# Altium project ESP32SSMB V1.2 .PrjPcb
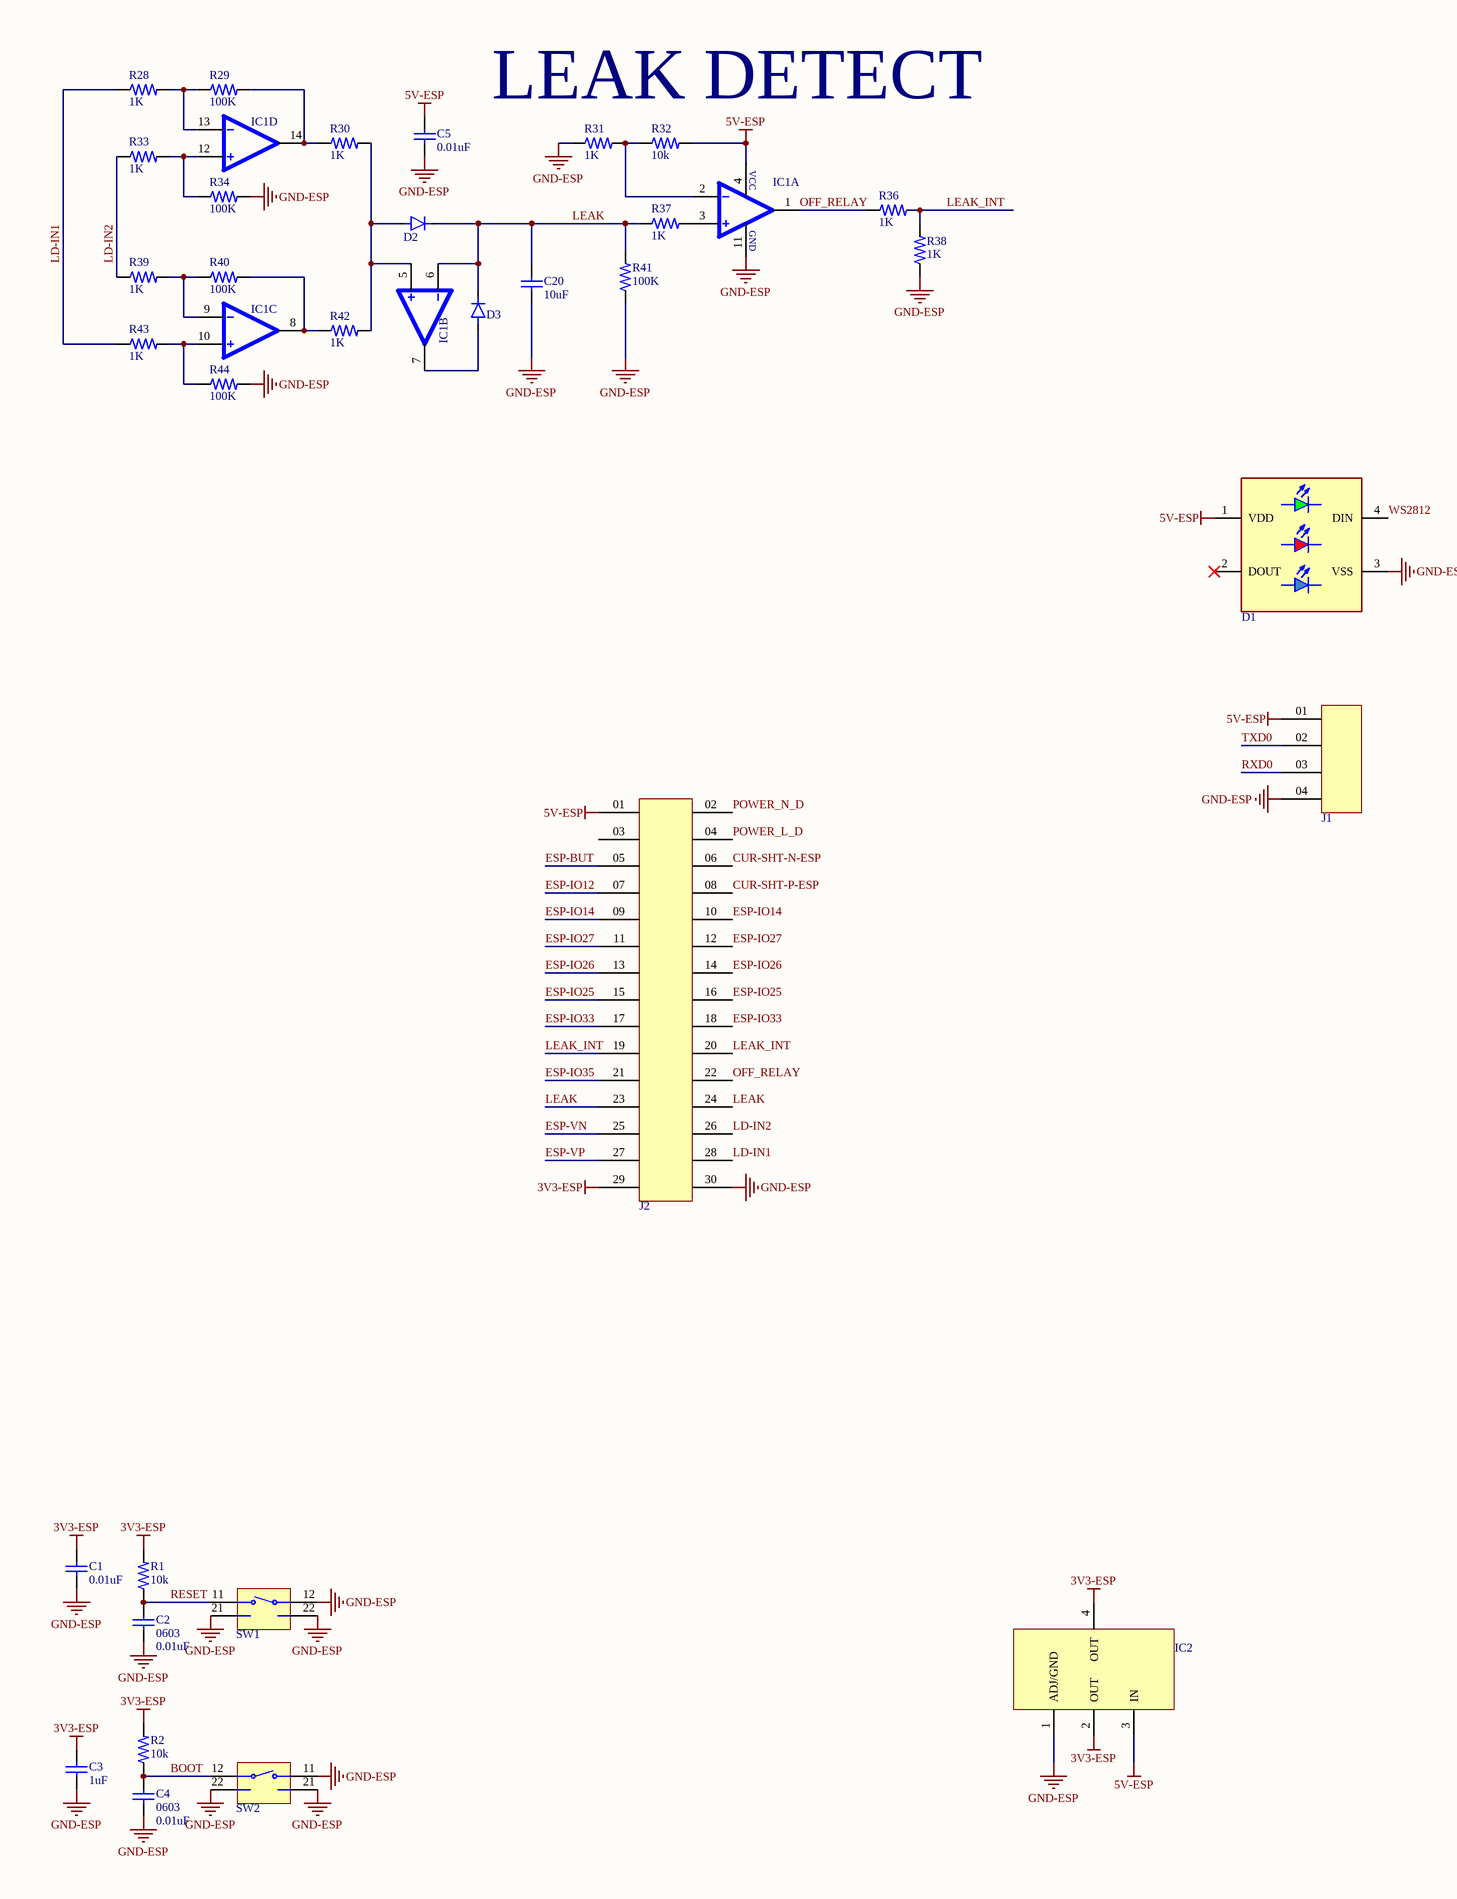
[diagram p0: ESP32SSMB V1.2 .SchDoc, left]
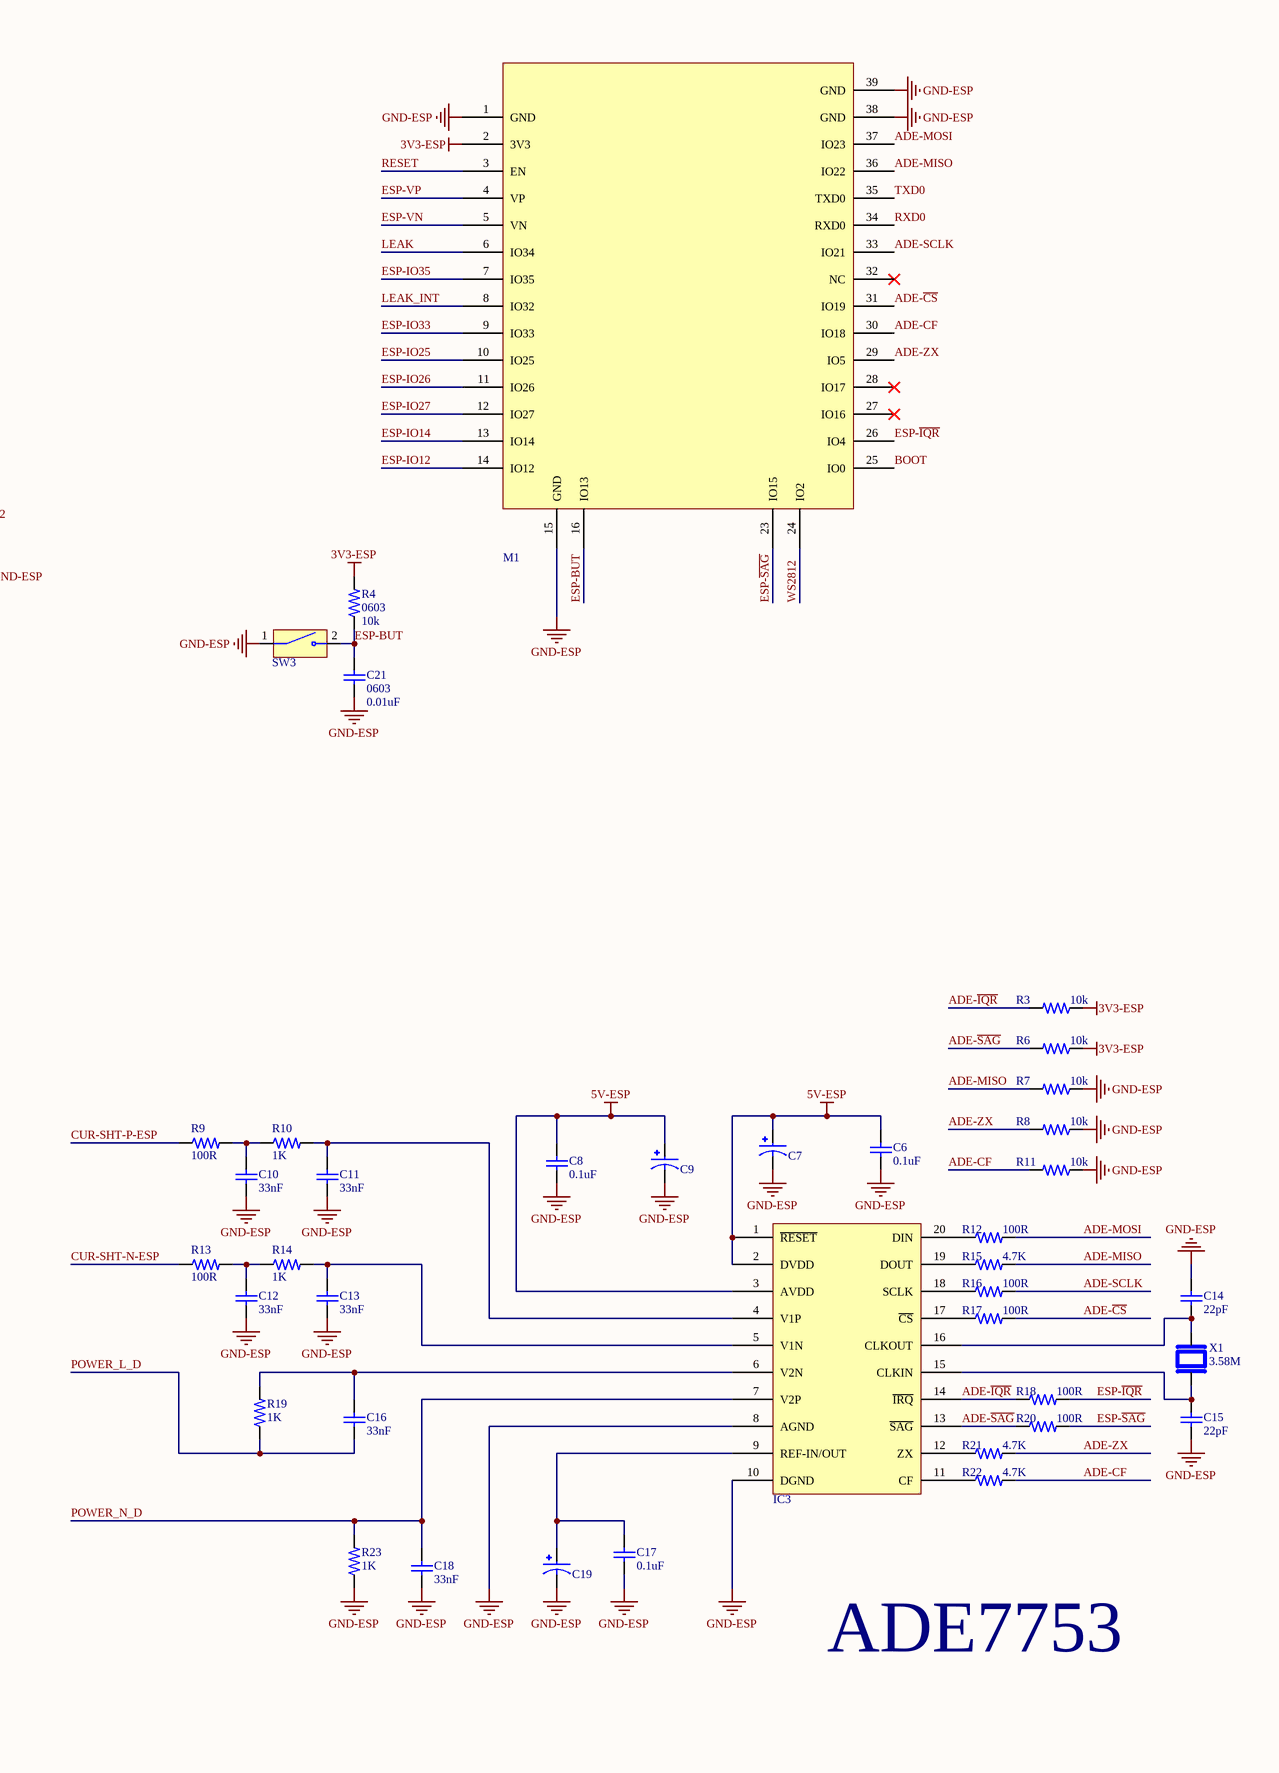
[diagram p1: ESP32SSMB V1.2 .SchDoc, right]
1 sheet, 72 parts. Net scope: global (net labels, ports and power ports of the same name join across sheets).
Board file: ESP32SSMB V1.2 .PcbDoc

## Sheet ESP32SSMB V1.2 .SchDoc
size A2; SheetNumber: 1; SheetTotal: 1

### Parts
C1  value 0.01uF  [SMD-CAP-0603-YAGEO]  (hidden comment: 0.1 µF ±10% 10V Ceramic Capacitor X7R 0603 (1608 Metric))
C2  value 0.01uF  Package: 0603  [SMD-CAP-0603-YAGEO]  (hidden comment: 10000 pF ±10% 16V Ceramic Capacitor X7R 0603 (1608 Metric))
C3  value 1uF  [SMD-CAP-0603-YAGEO]  (hidden comment: 1 µF ±10% 16V Ceramic Capacitor X7R 0603 (1608 Metric))
C4  value 0.01uF  Package: 0603  [SMD-CAP-0603-YAGEO]  (hidden comment: 10000 pF ±10% 16V Ceramic Capacitor X7R 0603 (1608 Metric))
C5  value 0.01uF  [SMD-CAP-0603-YAGEO]  (hidden comment: 0.1 µF ±10% 10V Ceramic Capacitor X7R 0603 (1608 Metric))
C6  value 0.1uF  [SMD-CAP-0603-YAGEO]  (hidden comment: 0.1 µF ±10% 16V Ceramic Capacitor X7R 0603 (1608 Metric))
C7  10 µF Molded Tantalum Capacitors 10 V 1206 (3216 Metric) 3.8Ohm  [SMD-CAP-TAN-1206-KEMET]  (value not drawn)
C8  value 0.1uF  [SMD-CAP-0603-YAGEO]  (hidden comment: 0.1 µF ±10% 16V Ceramic Capacitor X7R 0603 (1608 Metric))
C9  10 µF Molded Tantalum Capacitors 10 V 1206 (3216 Metric) 3.8Ohm  [SMD-CAP-TAN-1206-KEMET]  (value not drawn)
C10  value 33nF  [SMD-CAP-0603-KEMET]  (hidden comment: 0.033 µF ±5% 16V Ceramic Capacitor X7R 0603 (1608 Metric))
C11  value 33nF  [SMD-CAP-0603-KEMET]  (hidden comment: 0.033 µF ±5% 16V Ceramic Capacitor X7R 0603 (1608 Metric))
C12  value 33nF  [SMD-CAP-0603-KEMET]  (hidden comment: 0.033 µF ±5% 16V Ceramic Capacitor X7R 0603 (1608 Metric))
C13  value 33nF  [SMD-CAP-0603-KEMET]  (hidden comment: 0.033 µF ±5% 16V Ceramic Capacitor X7R 0603 (1608 Metric))
C14  value 22pF  [SMD-CAP-0603-YAGEO]  (hidden comment: 22 pF ±1% 50V Ceramic Capacitor C0G, NP0 0603 (1608 Metric))
C15  value 22pF  [SMD-CAP-0603-YAGEO]  (hidden comment: 22 pF ±1% 50V Ceramic Capacitor C0G, NP0 0603 (1608 Metric))
C16  value 33nF  [SMD-CAP-0603-KEMET]  (hidden comment: 0.033 µF ±5% 16V Ceramic Capacitor X7R 0603 (1608 Metric))
C17  value 0.1uF  [SMD-CAP-0603-YAGEO]  (hidden comment: 0.1 µF ±10% 16V Ceramic Capacitor X7R 0603 (1608 Metric))
C18  value 33nF  [SMD-CAP-0603-KEMET]  (hidden comment: 0.033 µF ±5% 16V Ceramic Capacitor X7R 0603 (1608 Metric))
C19  10 µF Molded Tantalum Capacitors 10 V 1206 (3216 Metric) 3.8Ohm  [SMD-CAP-TAN-1206-KEMET]  (value not drawn)
C20  value 10uF  [SMD-CAP-0805-KEMET]  (hidden comment: 10 µF ±10% 6.3V Ceramic Capacitor X5R 0805 (2012 Metric))
C21  value 0.01uF  Package: 0603  [SMD-CAP-0603-YAGEO]  (hidden comment: 10000 pF ±10% 16V Ceramic Capacitor X7R 0603 (1608 Metric))
D1  Addressable Lighting - LED Serial NRZ (Shift Register) Red, Green, Blue (RGB) 5.00mm L x 5.00mm W  [SMD-LxW-5.0x5.0-WS2812-4PIN]  (value not drawn)
D2  Diode 1000 V 1A Surface Mount SOD-123FL  [SOD-123FL-SMCDS]  (value not drawn)
D3  Diode 1000 V 1A Surface Mount SOD-123FL  [SOD-123FL-SMCDS]  (value not drawn)
IC1  General Purpose Amplifier 4 Circuit 14-SOIC  [SOIC-14]  (value not drawn)  (parts A,B,C,D of 4)
IC2  Linear Voltage Regulator IC Positive Fixed 1 Output 1A SOT-223-3  [SOT-223-3-DI]  (value not drawn)
IC3  Single Phase Meter IC 20-SSOP  [SSOP-20-ADI]  (value not drawn)
J1  Connector Header Through Hole 4 position 0.050" (1.27mm)  [HEADER-1.27-4 - U3D]  (value not drawn)
J2  HEADER; 15x2PIN; 2.54; HOR;  [HEADER-2.54-15x2-HOR]  (value not drawn)
M1  Bluetooth, WiFi 802.11b/g/n, Bluetooth v4.2 +EDR, Class 1, 2 and 3 Transceiver Module 2.4GHz ~ 2.5GHz Integrated, Trace Surface Mount  [MODULE-ESP32-WROVER - WROOM]  (value not drawn)
R1  value 10k  [SMD-RES-0603-SEI]  (hidden comment: 10 kOhms ±1% 0.25W, 1/4W Chip Resistor 0603 (1608 Metric) Automotive AEC-Q200, Pulse Withstanding Thick Film)
R2  value 10k  [SMD-RES-0603-SEI]  (hidden comment: 10 kOhms ±1% 0.25W, 1/4W Chip Resistor 0603 (1608 Metric) Automotive AEC-Q200, Pulse Withstanding Thick Film)
R3  value 10k  [SMD-RES-0603-SEI]  (hidden comment: 10 kOhms ±1% 0.25W, 1/4W Chip Resistor 0603 (1608 Metric) Automotive AEC-Q200, Pulse Withstanding Thick Film)
R4  value 10k  Package: 0603  [SMD-RES-0603-SEI]  (hidden comment: 10 kOhms ±1% 0.25W, 1/4W Chip Resistor 0603 (1608 Metric) Automotive AEC-Q200, Pulse Withstanding Thick Film)
R6  value 10k  [SMD-RES-0603-SEI]  (hidden comment: 10 kOhms ±1% 0.25W, 1/4W Chip Resistor 0603 (1608 Metric) Automotive AEC-Q200, Pulse Withstanding Thick Film)
R7  value 10k  [SMD-RES-0603-SEI]  (hidden comment: 10 kOhms ±1% 0.25W, 1/4W Chip Resistor 0603 (1608 Metric) Automotive AEC-Q200, Pulse Withstanding Thick Film)
R8  value 10k  [SMD-RES-0603-SEI]  (hidden comment: 10 kOhms ±1% 0.25W, 1/4W Chip Resistor 0603 (1608 Metric) Automotive AEC-Q200, Pulse Withstanding Thick Film)
R9  value 100R  [SMD-RES-0603-RS]  (hidden comment: 100 Ohms ±1% 0.1W, 1/10W Chip Resistor 0603 (1608 Metric) Automotive AEC-Q200, High Voltage Thick Film)
R10  value 1K  [SMD-RES-0603-SEI]  (hidden comment: 1 kOhms ±1% 0.25W, 1/4W Chip Resistor 0603 (1608 Metric) Automotive AEC-Q200, Pulse Withstanding Thick Film)
R11  value 10k  [SMD-RES-0603-SEI]  (hidden comment: 10 kOhms ±1% 0.25W, 1/4W Chip Resistor 0603 (1608 Metric) Automotive AEC-Q200, Pulse Withstanding Thick Film)
R12  value 100R  [SMD-RES-0603-RS]  (hidden comment: 100 Ohms ±1% 0.1W, 1/10W Chip Resistor 0603 (1608 Metric) Automotive AEC-Q200, High Voltage Thick Film)
R13  value 100R  [SMD-RES-0603-RS]  (hidden comment: 100 Ohms ±1% 0.1W, 1/10W Chip Resistor 0603 (1608 Metric) Automotive AEC-Q200, High Voltage Thick Film)
R14  value 1K  [SMD-RES-0603-SEI]  (hidden comment: 1 kOhms ±1% 0.25W, 1/4W Chip Resistor 0603 (1608 Metric) Automotive AEC-Q200, Pulse Withstanding Thick Film)
R15  value 4.7K  [SMD-RES-0603-RS]  (hidden comment: 4.7 kOhms ±1% 0.1W, 1/10W Chip Resistor 0603 (1608 Metric) Anti-Sulfur Thick Film)
R16  value 100R  [SMD-RES-0603-RS]  (hidden comment: 100 Ohms ±1% 0.1W, 1/10W Chip Resistor 0603 (1608 Metric) Automotive AEC-Q200, High Voltage Thick Film)
R17  value 100R  [SMD-RES-0603-RS]  (hidden comment: 100 Ohms ±1% 0.1W, 1/10W Chip Resistor 0603 (1608 Metric) Automotive AEC-Q200, High Voltage Thick Film)
R18  value 100R  [SMD-RES-0603-RS]  (hidden comment: 100 Ohms ±1% 0.1W, 1/10W Chip Resistor 0603 (1608 Metric) Automotive AEC-Q200, High Voltage Thick Film)
R19  value 1K  [SMD-RES-0603-SEI]  (hidden comment: 1 kOhms ±1% 0.25W, 1/4W Chip Resistor 0603 (1608 Metric) Automotive AEC-Q200, Pulse Withstanding Thick Film)
R20  value 100R  [SMD-RES-0603-RS]  (hidden comment: 100 Ohms ±1% 0.1W, 1/10W Chip Resistor 0603 (1608 Metric) Automotive AEC-Q200, High Voltage Thick Film)
R21  value 4.7K  [SMD-RES-0603-RS]  (hidden comment: 4.7 kOhms ±1% 0.1W, 1/10W Chip Resistor 0603 (1608 Metric) Anti-Sulfur Thick Film)
R22  value 4.7K  [SMD-RES-0603-RS]  (hidden comment: 4.7 kOhms ±1% 0.1W, 1/10W Chip Resistor 0603 (1608 Metric) Anti-Sulfur Thick Film)
R23  value 1K  [SMD-RES-0603-SEI]  (hidden comment: 1 kOhms ±1% 0.25W, 1/4W Chip Resistor 0603 (1608 Metric) Automotive AEC-Q200, Pulse Withstanding Thick Film)
R28  value 1K  [SMD-RES-0603-SEI]  (hidden comment: 1 kOhms ±1% 0.25W, 1/4W Chip Resistor 0603 (1608 Metric) Automotive AEC-Q200, Pulse Withstanding Thick Film)
R29  value 100K  [SMD-RES-0603-SEI]  (hidden comment: 100 kOhms ±5% 0.25W, 1/4W Chip Resistor 0603 (1608 Metric) Automotive AEC-Q200, Pulse Withstanding Thick Film)
R30  value 1K  [SMD-RES-0603-SEI]  (hidden comment: 1 kOhms ±1% 0.25W, 1/4W Chip Resistor 0603 (1608 Metric) Automotive AEC-Q200, Pulse Withstanding Thick Film)
R31  value 1K  [SMD-RES-0603-SEI]  (hidden comment: 1 kOhms ±1% 0.25W, 1/4W Chip Resistor 0603 (1608 Metric) Automotive AEC-Q200, Pulse Withstanding Thick Film)
R32  value 10k  [SMD-RES-0603-SEI]  (hidden comment: 10 kOhms ±1% 0.25W, 1/4W Chip Resistor 0603 (1608 Metric) Automotive AEC-Q200, Pulse Withstanding Thick Film)
R33  value 1K  [SMD-RES-0603-SEI]  (hidden comment: 1 kOhms ±1% 0.25W, 1/4W Chip Resistor 0603 (1608 Metric) Automotive AEC-Q200, Pulse Withstanding Thick Film)
R34  value 100K  [SMD-RES-0603-SEI]  (hidden comment: 100 kOhms ±5% 0.25W, 1/4W Chip Resistor 0603 (1608 Metric) Automotive AEC-Q200, Pulse Withstanding Thick Film)
R36  value 1K  [SMD-RES-0603-SEI]  (hidden comment: 1 kOhms ±1% 0.25W, 1/4W Chip Resistor 0603 (1608 Metric) Automotive AEC-Q200, Pulse Withstanding Thick Film)
R37  value 1K  [SMD-RES-0603-SEI]  (hidden comment: 1 kOhms ±1% 0.25W, 1/4W Chip Resistor 0603 (1608 Metric) Automotive AEC-Q200, Pulse Withstanding Thick Film)
R38  value 1K  [SMD-RES-0603-SEI]  (hidden comment: 1 kOhms ±1% 0.25W, 1/4W Chip Resistor 0603 (1608 Metric) Automotive AEC-Q200, Pulse Withstanding Thick Film)
R39  value 1K  [SMD-RES-0603-SEI]  (hidden comment: 1 kOhms ±1% 0.25W, 1/4W Chip Resistor 0603 (1608 Metric) Automotive AEC-Q200, Pulse Withstanding Thick Film)
R40  value 100K  [SMD-RES-0603-SEI]  (hidden comment: 100 kOhms ±5% 0.25W, 1/4W Chip Resistor 0603 (1608 Metric) Automotive AEC-Q200, Pulse Withstanding Thick Film)
R41  value 100K  [SMD-RES-0603-SEI]  (hidden comment: 100 kOhms ±5% 0.25W, 1/4W Chip Resistor 0603 (1608 Metric) Automotive AEC-Q200, Pulse Withstanding Thick Film)
R42  value 1K  [SMD-RES-0603-SEI]  (hidden comment: 1 kOhms ±1% 0.25W, 1/4W Chip Resistor 0603 (1608 Metric) Automotive AEC-Q200, Pulse Withstanding Thick Film)
R43  value 1K  [SMD-RES-0603-SEI]  (hidden comment: 1 kOhms ±1% 0.25W, 1/4W Chip Resistor 0603 (1608 Metric) Automotive AEC-Q200, Pulse Withstanding Thick Film)
R44  value 100K  [SMD-RES-0603-SEI]  (hidden comment: 100 kOhms ±5% 0.25W, 1/4W Chip Resistor 0603 (1608 Metric) Automotive AEC-Q200, Pulse Withstanding Thick Film)
SW1  https://www.digikey.com/en/products/detail/panasonic-electronic-components/EVQ-P7L01P/4429453  [SW-HxLxW-1.1x3.5x2.9-PEC]  (value not drawn)
SW2  https://www.digikey.com/en/products/detail/panasonic-electronic-components/EVQ-P7L01P/4429453  [SW-HxLxW-1.1x3.5x2.9-PEC]  (value not drawn)
SW3  Tactile Switch SPST-NO Top Actuated Surface Mount  [SW-HxLxW-5.0x6.0x3.5-C&K]  (value not drawn)
X1  value 3.58M  [SMD-HC-49/US-ALLC]  (hidden comment: 3.579545 MHz ±20ppm Crystal 18pF 180 Ohms HC-49/US)

### Nets
3V3-ESP: C1.2 C3.2 IC2.2(OUT) IC2.4(OUT) J2.29 M1.2(3V3) R1.2 R2.2 R3.1 R4.2 R6.1
5V-ESP: C5.2 C6.2 C7.1 C8.2 C9.1 D1.1(VDD) IC1.4(VCC) IC2.3(IN) IC3.1(~{RESET}) IC3.2(DVDD) IC3.3(AVDD) J1.01 J2.01 R32.2
GND-ESP: C1.1 C2.1 C3.1 C4.1 C5.1 C6.1 C7.2 C8.1 C9.2 C10.1 C11.1 C12.1 C13.1 C14.1 C15.2 C17.1 C18.1 C19.2 C20.1 C21.1 D1.3(VSS) IC1.11(GND) IC2.1(ADJ/GND) IC3.8(AGND) IC3.10(DGND) J1.04 J2.30 M1.1(GND) M1.15(GND) M1.38(GND) M1.39(GND) R7.1 R8.1 R11.1 R23.1 R31.1 R34.2 R38.1 R41.1 R44.2 SW1.12 SW1.21 SW1.22 SW2.11 SW2.21 SW2.22 SW3.1(COM)
ADE-~{CS}: M1.31(IO19) R17.2
ADE-CF: M1.30(IO18) R11.2 R22.2
ADE-~{IQR}: IC3.14(~{IRQ}) R3.2 R18.1
ADE-MISO: M1.36(IO22) R7.2 R15.2
ADE-MOSI: M1.37(IO23) R12.2
ADE-~{SAG}: IC3.13(~{SAG}) R6.2 R20.1
ADE-SCLK: M1.33(IO21) R16.2
ADE-ZX: M1.29(IO5) R8.2 R21.2
BOOT: C4.2 M1.25(IO0) R2.1 SW2.12
CUR-SHT-N-ESP: J2.06 R13.1
CUR-SHT-P-ESP: J2.08 R9.1
ESP-BUT: C21.2 J2.05 M1.16(IO13) R4.1 SW3.2(NO)
ESP-~{IQR}: M1.26(IO4) R18.2
ESP-IO12: J2.07 M1.14(IO12)
ESP-IO14: J2.09 J2.10 M1.13(IO14)
ESP-IO25: J2.15 J2.16 M1.10(IO25)
ESP-IO26: J2.13 J2.14 M1.11(IO26)
ESP-IO27: J2.11 J2.12 M1.12(IO27)
ESP-IO33: J2.17 J2.18 M1.9(IO33)
ESP-IO35: J2.21 M1.7(IO35)
ESP-~{SAG}: M1.23(IO15) R20.2
ESP-VN: J2.25 M1.5(VN)
ESP-VP: J2.27 M1.4(VP)
LD-IN1: J2.28 R28.1 R43.1
LD-IN2: J2.26 R33.1 R39.1
LEAK: C20.2 D2.K D3.K IC1.6(2IN-) J2.23 J2.24 M1.6(IO34) R37.1 R41.2
LEAK_INT: J2.19 J2.20 M1.8(IO32) R36.2 R38.2
OFF_RELAY: IC1.1(1OUT) J2.22 R36.1
POWER_L_D: C16.1 J2.04 R19.1
POWER_N_D: C18.2 IC3.7(V2P) J2.02 R23.2
RESET: C2.2 M1.3(EN) R1.1 SW1.11
RXD0: J1.03 M1.34(RXD0)
TXD0: J1.02 M1.35(TXD0)
WS2812: D1.4(DIN) M1.24(IO2)
NetC10_2: C10.2 R9.2 R10.1
NetC11_2: C11.2 IC3.4(V1P) R10.2
NetC12_2: C12.2 R13.2 R14.1
NetC13_2: C13.2 IC3.5(V1N) R14.2
NetC14_2: C14.2 IC3.16(CLKOUT) X1.1
NetC15_1: C15.1 IC3.15(CLKIN) X1.2
NetC16_2: C16.2 IC3.6(V2N) R19.2
NetC17_2: C17.2 C19.1 IC3.9(REF-IN/OUT)
NetD2_A: D2.A IC1.5(2IN+) R30.2 R42.2
NetD3_A: D3.A IC1.7(2OUT)
NetIC1_2: IC1.2(1IN-) R31.2 R32.1
NetIC1_3: IC1.3(1IN+) R37.2
NetIC1_8: IC1.8(3OUT) R40.2 R42.1
NetIC1_9: IC1.9(3IN-) R39.2 R40.1
NetIC1_10: IC1.10(3IN+) R43.2 R44.1
NetIC1_12: IC1.12(4IN+) R33.2 R34.1
NetIC1_13: IC1.13(4IN-) R28.2 R29.1
NetIC1_14: IC1.14(4OUT) R29.2 R30.1
NetIC3_11: IC3.11(CF) R22.1
NetIC3_12: IC3.12(ZX) R21.1
NetIC3_17: IC3.17(~{CS}) R17.1
NetIC3_18: IC3.18(SCLK) R16.1
NetIC3_19: IC3.19(DOUT) R15.1
NetIC3_20: IC3.20(DIN) R12.1

Not connected (* = marked no-connect by the designer): D1 2(DOUT)*; J2 03; M1 27(IO16)* 28(IO17)* 32(NC)*

### Notes on the sheet
- LEAK DETECT
- ADE7753

### Library data of the parts
C1 C5 = CAP; 0.1uF; 10V; 0603; SMD; CC0603KRX7R6BB104: Multilayer Ceramic Capacitor, 0.1 uF, 10 V, ± 10%, X7R, 0603 [1608 Metric]; Manufacturer: Yageo; Material: 4241ConductorMaterial; Designer: TVBac; Supplier: Digikey; Supplier Part Number: 311-4055-1-ND; Manufacturer Part Number: CC0603KRX7R6BB104; RoHS: Yes; Category: Ceramic Capacitors; Stock: 113177; Pricing: 1=0.1, 10=0.067, 50=0.0398, 100=0.0314, 500=0.02316, 1000=0.01918, 4000=0.01633, 8000=0.01519, 12000=0.01443, 28000=0.01367, 100000=0.01035, 200000=0.0101, 400000=0.00949 (USD); Lead Free: 5697LeadFree; Halogen Free: 5694HalogenFree; ComponentLink1URL: https://datasheet.ciiva.com/11586/upy-gphc-x7r-6-3v-to-50v-8-11586327.pdf?src-supplier=Avnet; ComponentLink1Description: https://datasheet.ciiva.com/11586/upy-gphc-x7r-6-3v-to-50v-8-11586327.pdf?src-supplier=Avnet; ComponentLink2Description: Link Digikey; ComponentLink2URL: https://www.digikey.com/en/products/detail/yageo/CC0603KRX7R6BB104/5883741
C2 C4 C21 = CAP; 0.01uF; 16V; 0603; SMD; CC0603KRX7R7BB103: Multilayer Ceramic Capacitor, 0.01 uF, 16 V, ± 10%, X7R, 0603 [1608 Metric]; Manufacturer: Yageo; Material: 4241ConductorMaterial; Designer: TVBac; Supplier: Digikey; Supplier Part Number: 311-3369-1-ND; Manufacturer Part Number: CC0603KRX7R7BB103; RoHS: Yes; Category: Ceramic Capacitors; Stock: 24661; Pricing: 1=0.1, 10=0.041, 50=0.0236, 100=0.0183, 500=0.01378, 1000=0.01083 (USD); Lead Free: 5697LeadFree; ComponentLink1URL: https://datasheet.ciiva.com/7978/1489800-7978139.pdf?src-supplier=Element14; ComponentLink1Description: https://datasheet.ciiva.com/7978/1489800-7978139.pdf?src-supplier=Element14; ComponentLink2Description: Link Digikey; ComponentLink2URL: https://www.digikey.com/en/products/detail/yageo/CC0603KRX7R7BB103/5883753
C3 = CAP; 1uF; 16V; 0603; SMD; CC0603KRX7R7BB105: 0603 1 uF 16 V ±10 % Tolerance X7R SMT Multilayer Ceramic Capacitor; Manufacturer: Yageo; Material: 4241ConductorMaterial; Dissipation Factor: 5%; Designer: TVBac; Supplier: Digikey; Supplier Part Number: 311-1446-1-ND; Manufacturer Part Number: CC0603KRX7R7BB105; RoHS: Yes; Category: Ceramic Capacitors; Stock: 9165861; Pricing: 1=0.1, 10=0.066, 50=0.0392, 100=0.0308, 500=0.02274, 1000=0.01882, 4000=0.01785, 8000=0.01626, 12000=0.01545, 20000=0.01456, 28000=0.01404, 40000=0.01353, 100000=0.01313 (USD); Mounting Technology: Surface Mount; Case/Package: 0603; Pins: 2; Case Code (Metric): 1608; Case Code (Imperial): 0603; Min Operating Temperature: -55°C; Max Operating Temperature: 125°C; Tolerance: 10%; Voltage Rating: 16V; Package Quantity: 1; Packaging: Tape and Reel; Voltage Rating (DC): 16V; Dielectric: X7R; Termination: SMD/SMT; Voltage: 16V; Series: CC; Construction: Flat; Length: 1.6mm; Width: 0.031inch; Height: 0.8mm; Thickness: 0.035inch; Depth: 0.8mm; Radiation Hardening: No; RoHS Compliant: Yes; Reach SVHC Compliant: Unknown; Lead Free: 5697LeadFree; Halogen Free: 5694HalogenFree; ComponentLink1URL: https://datasheet.ciiva.com/8033/1734573-8033801.pdf?src-supplier=Element14; ComponentLink1Description: https://datasheet.ciiva.com/8033/1734573-8033801.pdf?src-supplier=Element14; ComponentLink2URL: https://datasheet.ciiva.com/8033/1734573-8033800.pdf?src-supplier=Element14; ComponentLink2Description: https://datasheet.ciiva.com/8033/1734573-8033800.pdf?src-supplier=Element14; ComponentLink3URL: https://datasheet.ciiva.com/7978/1489800-7978143.pdf?src-supplier=Element14; ComponentLink3Description: https://datasheet.ciiva.com/7978/1489800-7978143.pdf?src-supplier=Element14; ComponentLink4URL: https://datasheet.ciiva.com/28450/1489800-28450557.pdf?src-supplier=Element14; ComponentLink4Description: https://datasheet.ciiva.com/28450/1489800-28450557.pdf?src-supplier=Element14; ComponentLink5URL: https://datasheet.ciiva.com/176/mlccorderingcode-176789.pdf?src-supplier=Digikey; ComponentLink5Description: https://datasheet.ciiva.com/176/mlccorderingcode-176789.pdf?src-supplier=Digikey; ComponentLink6URL: https://datasheet.ciiva.com/176/mlccorderingcode-176788.pdf?src-supplier=Digikey; ComponentLink6Description: https://datasheet.ciiva.com/176/mlccorderingcode-176788.pdf?src-supplier=Digikey; ComponentLink7URL: https://datasheet.ciiva.com/176/mlccorderingcode-176790.pdf?src-supplier=Digikey; ComponentLink7Description: https://datasheet.ciiva.com/176/mlccorderingcode-176790.pdf?src-supplier=Digikey; ComponentLink8URL: https://datasheet.ciiva.com/5425/upy-gphc-x7r-6-3v-to-50v-8-12304-5425495.pdf?src-supplier=Mouser; ComponentLink8Description: https://datasheet.ciiva.com/5425/upy-gphc-x7r-6-3v-to-50v-8-12304-5425495.pdf?src-supplier=Mouser; ComponentLink9Description: Link Digikey; ComponentLink9URL: https://www.digikey.com/en/products/detail/yageo/CC0603KRX7R7BB105/2833611?s=N4IgTCBcDaIMJwAwDZEGYDSAlAGgdizwCEiBGRAVhAF0BfIA
C6 C8 C17 = CAP; 0.1uF; 16V; 0603; SMD; CC0603KRX7R7BB104: 0603 0.1 uF 16 V ±10 % Tolerance X7R SMT Multilayer Ceramic Capacitor; Manufacturer: Yageo; Insulation Resistance: 100GR; Designer: TVBac; Supplier: Digikey; Supplier Part Number: 311-1088-1-ND; Manufacturer Part Number: CC0603KRX7R7BB104; RoHS: Yes; Category: Ceramic Capacitors; Stock: 8705780; Pricing: 1=0.1, 10=0.042, 50=0.0238, 100=0.0185, 500=0.01392, 1000=0.01094, 4000=0.00915, 8000=0.00836, 12000=0.00796, 28000=0.00756, 100000=0.00547, 200000=0.00529, 400000=0.00497 (USD); Mounting Technology: Surface Mount; Case/Package: 0603; Pins: 2; Case Code (Metric): 1608; Case Code (Imperial): 0603; Material: Ceramic; Min Operating Temperature: -55°C; Max Operating Temperature: 125°C; Voltage Rating: 16V; Tolerance: 10%; Voltage Rating (DC): 16V; Package Quantity: 1; Packaging: Tape and Reel; Dielectric: X7R; Termination: SMD/SMT; Voltage: 16V; Series: CC; Length: 1.6mm; Width: 0.031inch; Height: 0.8mm; Thickness: 0.035inch; Depth: 0.8mm; Radiation Hardening: No; Reach SVHC Compliant: No; Lead Free: Lead Free; Halogen Free: Halogen Free; RoHS Compliant: Yes; ComponentLink1URL: https://datasheet.ciiva.com/11786/0900766b80d84f1d-11786077.pdf?src-supplier=Rs; ComponentLink1Description: https://datasheet.ciiva.com/11786/0900766b80d84f1d-11786077.pdf?src-supplier=Rs; ComponentLink2URL: https://datasheet.ciiva.com/8033/70765-8033799.pdf?src-supplier=Element14; ComponentLink2Description: https://datasheet.ciiva.com/8033/70765-8033799.pdf?src-supplier=Element14; ComponentLink3URL: https://datasheet.ciiva.com/7978/1489800-7978141.pdf?src-supplier=Element14; ComponentLink3Description: https://datasheet.ciiva.com/7978/1489800-7978141.pdf?src-supplier=Element14; ComponentLink4URL: https://datasheet.ciiva.com/28450/1489800-28450552.pdf?src-supplier=Element14; ComponentLink4Description: https://datasheet.ciiva.com/28450/1489800-28450552.pdf?src-supplier=Element14; ComponentLink5URL: https://datasheet.ciiva.com/46430/1734573-46430156.pdf?src-supplier=Element14; ComponentLink5Description: https://datasheet.ciiva.com/46430/1734573-46430156.pdf?src-supplier=Element14; ComponentLink6URL: https://datasheet.ciiva.com/144/mlccorderingcode-144183.pdf?src-supplier=Digikey; ComponentLink6Description: https://datasheet.ciiva.com/144/mlccorderingcode-144183.pdf?src-supplier=Digikey; ComponentLink7URL: https://datasheet.ciiva.com/144/mlccorderingcode-144182.pdf?src-supplier=Digikey; ComponentLink7Description: https://datasheet.ciiva.com/144/mlccorderingcode-144182.pdf?src-supplier=Digikey; ComponentLink8URL: https://datasheet.ciiva.com/144/mlccorderingcode-144184.pdf?src-supplier=Digikey; ComponentLink8Description: https://datasheet.ciiva.com/144/mlccorderingcode-144184.pdf?src-supplier=Digikey; ComponentLink9URL: https://datasheet.ciiva.com/8033/1734573-8033797.pdf?src-supplier=Element14; ComponentLink9Description: https://datasheet.ciiva.com/8033/1734573-8033797.pdf?src-supplier=Element14; ComponentLink10URL: https://datasheet.ciiva.com/13395/upy-gphc-x7r-6-3v-to-50v-8-13395674.pdf?src-supplier=Mouser; ComponentLink10Description: https://datasheet.ciiva.com/13395/upy-gphc-x7r-6-3v-to-50v-8-13395674.pdf?src-supplier=Mouser; ComponentLink11URL: https://datasheet.ciiva.com/11464/upy-gphc-x7r-6-3v-to-50v-8-11464735.pdf?src-supplier=Avnet; ComponentLink11Description: https://datasheet.ciiva.com/11464/upy-gphc-x7r-6-3v-to-50v-8-11464735.pdf?src-supplier=Avnet; ComponentLink12URL: https://datasheet.ciiva.com/15165/getdatasheetpartid-63554-15165387.pdf?src-supplier=Verical; ComponentLink12Description: https://datasheet.ciiva.com/15165/getdatasheetpartid-63554-15165387.pdf?src-supplier=Verical; ComponentLink13Description: Link Digikey; ComponentLink13URL: https://www.digikey.com/en/products/detail/yageo/CC0603KRX7R7BB104/302822
C7 C9 C19 = CAP; CAP_TAN; 10uF; 10V; T491A106M010AT: Capacitor, Tantalum, Solid, Polarized, 10 V, 10 Uf, Surface Mount, 1206, Lead Free; Manufacturer: KEMET; Tolerance: 20%; ESR (Equivalent Series Resistance): 4R; Voltage Rating: 10V; Leakage Current: 1uA; Polarity: Polar; Dissipation Factor: 6%; Ripple Current: 137mA; Designer: TVBac; Supplier: Mouser; Supplier Part Number: 80-T491A106M010; Manufacturer Part Number: T491A106M010AT; RoHS: Yes; Category: Tantalum Capacitors; Stock: 78299; Pricing: 1=0.29, 10=0.152, 50=0.152, 100=0.098, 1000=0.083, 2000=0.076, 10000=0.071, 50000=0.069 (USD); Mounting Technology: Surface Mount,PCB; Case/Package: 1206; Pins: 2; Case Code (Metric): 3216; Case Code (Imperial): 1206; Weight: 0.000571oz; Dielectric Material: Tantalum; Min Operating Temperature: -55°C; Max Operating Temperature: 125°C; Packaging: Tape and Reel; Voltage Rating (DC): 10V; Termination: SMD/SMT; Voltage: 10V; Features: General Purpose; Series: T491; Construction: Flat; Length: 3.2mm; Width: 1.6mm; Height: 1.6mm; Depth: 1.6mm; Lead Pitch: 1.2mm; Size: 1.6mm; Reach SVHC Compliant: No; Lead Free: Lead Free; RoHS Compliant: Yes; ComponentLink1URL: https://datasheet.ciiva.com/27052/1573273-27052561.pdf?src-supplier=Jameco; ComponentLink1Description: https://datasheet.ciiva.com/27052/1573273-27052561.pdf?src-supplier=Jameco; ComponentLink2URL: https://datasheet.ciiva.com/257/kem-t2005-t491-257587.pdf?src-supplier=Digikey; ComponentLink2Description: https://datasheet.ciiva.com/257/kem-t2005-t491-257587.pdf?src-supplier=Digikey; ComponentLink3URL: https://datasheet.ciiva.com/7668/kem-t2005-t491-7668140.pdf?src-supplier=Element14; ComponentLink3Description: https://datasheet.ciiva.com/7668/kem-t2005-t491-7668140.pdf?src-supplier=Element14; ComponentLink4URL: https://datasheet.ciiva.com/257/kem-t2005-t491-257588.pdf?src-supplier=Digikey; ComponentLink4Description: https://datasheet.ciiva.com/257/kem-t2005-t491-257588.pdf?src-supplier=Digikey; ComponentLink5URL: https://datasheet.ciiva.com/257/kem-t2005-t491-257589.pdf?src-supplier=Digikey; ComponentLink5Description: https://datasheet.ciiva.com/257/kem-t2005-t491-257589.pdf?src-supplier=Digikey; ComponentLink6URL: https://datasheet.ciiva.com/14601/70095774-14601994.pdf?src-supplier=Allied+Electronics; ComponentLink6Description: https://datasheet.ciiva.com/14601/70095774-14601994.pdf?src-supplier=Allied+Electronics; ComponentLink7URL: https://datasheet.ciiva.com/14602/70095774-14602172.pdf?src-supplier=Allied+Electronics; ComponentLink7Description: https://datasheet.ciiva.com/14602/70095774-14602172.pdf?src-supplier=Allied+Electronics; ComponentLink8URL: https://datasheet.ciiva.com/12910/kem-t2005-t491-12910559.pdf?src-supplier=Mouser; ComponentLink8Description: https://datasheet.ciiva.com/12910/kem-t2005-t491-12910559.pdf?src-supplier=Mouser; ComponentLink9Description: Link Digikey; ComponentLink9URL: https://www.digikey.com/en/products/detail/kemet/T491A106M010AT/818547
C10-C13 C16 C18 = CAP; 0.033uF; 33nF; 0603; 16V; C0603C333J4REC7411: Multilayer Ceramic Capacitors MLCC - SMD/SMT 16V 0.033uF X7R 0603 5%; Manufacturer: KEMET; Designer: TVBac; Supplier: Mouser; Supplier Part Number: 80-C0603C333J4RECLR; Manufacturer Part Number: C0603C333J4REC7411; RoHS: Yes; Category: Ceramic Capacitors; Stock: 17910; Pricing: 1=0.13, 10=0.057, 50=0.057, 100=0.033, 1000=0.025, 2500=0.022, 10000=0.02, 15000=0.018, 45000=0.017, 90000=0.014 (USD); ComponentLink1URL: https://api.kemet.com/component-edge/download/datasheet/C0603C333J4REC7411.pdf?src-supplier=Digikey; ComponentLink1Description: https://api.kemet.com/component-edge/download/datasheet/C0603C333J4REC7411.pdf?src-supplier=Digikey; ComponentLink2Description: Link Digikey; ComponentLink2URL: https://www.digikey.com/en/products/detail/kemet/C0603C333J4REC7411/8645086
C14 C15 = CAP; 22pF; 50V; SMD; CC0603FRNPO9BN220: Multilayer Ceramic Capacitor, 22 pF, 50 V, ï¿½ 1%, C0G (NP0), 0603 [1608 Metric]; Manufacturer: Yageo; Designer: TVBac; Supplier: Future Electronics; Supplier Part Number: 1000074; Manufacturer Part Number: CC0603FRNPO9BN220; RoHS: Yes; Category: Ceramic Capacitors; Stock: 144000; Pricing: 4000=0.0159, 12000=0.0156, 20000=0.0154, 80000=0.0149, 120000=0.0147 (USD); Lead Free: 5697LeadFree; Halogen Free: 5694HalogenFree; ComponentLink1URL: https://datasheet.ciiva.com/13211/upy-gp-np0-16v-to-50v-8-13211061.pdf?src-supplier=Mouser; ComponentLink1Description: https://datasheet.ciiva.com/13211/upy-gp-np0-16v-to-50v-8-13211061.pdf?src-supplier=Mouser; ComponentLink2Description: Link Digikey; ComponentLink2URL: https://www.digikey.com/en/products/detail/yageo/CC0603FRNPO9BN220/5883497
C20 = CAP; 10uF; 10V; 0805; C0805C106K9PACTU: Multilayer Ceramic Capacitor, 10 uF, 6.3 V, ï¿½ 10%, X5R, 0805 [2012 Metric]; Manufacturer: KEMET; Material: 4241ConductorMaterial; Dissipation Factor: 5%; Designer: TVBac; Supplier: Mouser; Supplier Part Number: 80-C0805C106K9P; Manufacturer Part Number: C0805C106K9PACTU; RoHS: Yes; Category: Ceramic Capacitors; Stock: 133022; Pricing: 1=0.12, 10=0.074, 50=0.074, 100=0.044, 1000=0.033, 3000=0.026, 9000=0.025, 10000=0.025, 24000=0.023, 45000=0.022, 99000=0.019 (USD); Mounting Technology: Surface Mount; Case/Package: 0805; Pins: 2; Case Code (Imperial): 0805; Case Code (Metric): 2012; Contact Material: Tin; Dielectric Material: 4241ConductorMaterial; Min Operating Temperature: -55°C; Max Operating Temperature: 85°C; Tolerance: 10%; Packaging: Tape and Reel; Package Quantity: 3000; Voltage Rating: 6.3V; Voltage Rating (DC): 6.3V; Dielectric: X5R; Termination: SMD/SMT; Series: SMD Comm X5R; Construction: Flat; Voltage Rating (AC): 6.3V; Length: 2mm; Width: 1.2mm; Height: 1.25mm; Depth: 1.25mm; Lead Pitch: 0.75mm; Radiation Hardening: No; Reach SVHC Compliant: No; RoHS Compliant: Yes; Lead Free: 5697LeadFree; ComponentLink1URL: https://datasheet.ciiva.com/7842/kem-c1006-x5r-smd-7842200.pdf?src-supplier=Element14; ComponentLink1Description: https://datasheet.ciiva.com/7842/kem-c1006-x5r-smd-7842200.pdf?src-supplier=Element14; ComponentLink2URL: https://datasheet.ciiva.com/7842/kem-c1006-x5r-smd-7842201.pdf?src-supplier=Element14; ComponentLink2Description: https://datasheet.ciiva.com/7842/kem-c1006-x5r-smd-7842201.pdf?src-supplier=Element14; ComponentLink3URL: https://datasheet.ciiva.com/18193/getdatasheetpartid-320652-18193500.pdf?src-supplier=Verical; ComponentLink3Description: https://datasheet.ciiva.com/18193/getdatasheetpartid-320652-18193500.pdf?src-supplier=Verical; ComponentLink4Description: Link Digikey; ComponentLink4URL: https://www.digikey.com/en/products/detail/kemet/C0805C106K9PAC7800/551604
D1 = LED; RGB; WS2812; COM-16347: Address Led Red/grn/blue; Manufacturer: SparkFun; Designer: TVBac; Supplier: Digikey; Supplier Part Number: 1568-COM-16347CT-ND; Manufacturer Part Number: COM-16347; RoHS: No; Category: Optoelectronics; Stock: 32070; Pricing: 1=0.6 (USD); ComponentLink1URL: http://cdn.sparkfun.com/datasheets/BreakoutBoards/WS2812B.pdf?src-supplier=Digikey; ComponentLink1Description: http://cdn.sparkfun.com/datasheets/BreakoutBoards/WS2812B.pdf?src-supplier=Digikey; ComponentLink2Description: Link Digikey; ComponentLink2URL: https://www.digikey.com/en/products/detail/sparkfun-electronics/COM-16347/11630204
D2 D3 = DIODE; SMD; 1N4007FLN4007;: Diode Gen Purp 1KV 1A SOD123FL; Manufacturer: Sangdest Microelectronics; Value: 6pF; Max Forward Surge Current (Ifsm): 30A; Max Reverse Current: 5uA; Designer: TVBac; Supplier: Digikey; Supplier Part Number: 1655-1N4007FLCT-ND; Manufacturer Part Number: 1N4007FL; RoHS: No; Category: Diodes; Stock: 332632; Pricing: 1=0.1, 10=0.058, 100=0.039, 500=0.02954, 1000=0.02627 (USD); Min Operating Temperature: -55°C; Max Operating Temperature: 150°C; Forward Current: 1A; Max Repetitive Reverse Voltage (Vrrm): 1kV; Reverse Voltage: 1kV; Height: 1.1mm; ComponentLink1Description: Link Digikey; ComponentLink1URL: https://www.digikey.com/en/products/detail/smc-diode-solutions/1N4007FL/11657817
IC1 = OPAM; SMD; LM324DR: Quad 30-V 1.2-MHz operational amplifier 14-SOIC 0 to 70; Manufacturer: Texas Instruments; Common Mode Rejection Ratio: 65dB; Number of Channels: 4; Output Current: 30mA; Max Supply Voltage: 32V; Min Supply Voltage: 3V; Slew Rate: 0.5V/µs; Min Dual Supply Voltage: 1.5V; Max Dual Supply Voltage: 16V; Voltage Gain: 100dB; Unity Gain Bandwidth Product: 1.2MHz; Input Offset Voltage (Vos): 7mV; Input Bias Current: 250nA; Operating Supply Current: 1.4mA; Output Current per Channel: 40mA; Supply Current: 3mA; Designer: TVBac; Supplier: Digikey; Supplier Part Number: 296-14597-1-ND; Manufacturer Part Number: LM324DR; RoHS: Yes; Category: Amplifiers - Op Amps, Buffer, Instrumentation; Stock: 58799; Pricing: 1=0.23, 10=0.152, 25=0.132, 100=0.1105, 250=0.10008, 500=0.09382, 1000=0.08867, 2500=0.08322, 5000=0.07994, 7500=0.0783, 12500=0.07647, 17500=0.07541, 25000=0.07438, 62500=0.07218, 125000=0.07085 (USD); Mounting Technology: Surface Mount; Case/Package: SOIC; Pins: 14; Min Operating Temperature: 0°C; Max Operating Temperature: 70°C; Package Quantity: 2500; Packaging: Tape and Reel; Bandwidth: 1.2MHz; Operating Supply Voltage: 16V; Gain Bandwidth Product: 1.2MHz; Number of Circuits: 4; Number of Amplifiers: 4; Number of Elements: 4; Series: -; Amplifier Type: GENERAL PURPOSE; Technology: BIPOLAR; Thickness: 1.58mm; Radiation Hardening: No; Reach SVHC Compliant: No; Lead Free: Lead Free; RoHS Compliant: Yes; ComponentLink1URL: https://datasheet.ciiva.com/34301/902590-34301708.pdf?src-supplier=Jameco; ComponentLink1Description: https://datasheet.ciiva.com/34301/902590-34301708.pdf?src-supplier=Jameco; ComponentLink2URL: https://datasheet.ciiva.com/1795/lm224-1795532.pdf?src-supplier=Digikey; ComponentLink2Description: https://datasheet.ciiva.com/1795/lm224-1795532.pdf?src-supplier=Digikey; ComponentLink3URL: https://datasheet.ciiva.com/1795/lm224-1795533.pdf?src-supplier=Digikey; ComponentLink3Description: https://datasheet.ciiva.com/1795/lm224-1795533.pdf?src-supplier=Digikey; ComponentLink4URL: https://datasheet.ciiva.com/1795/lm224-1795534.pdf?src-supplier=Digikey; ComponentLink4Description: https://datasheet.ciiva.com/1795/lm224-1795534.pdf?src-supplier=Digikey; ComponentLink5URL: https://datasheet.ciiva.com/5997/1768103-5997421.pdf?src-supplier=Farnell; ComponentLink5Description: https://datasheet.ciiva.com/5997/1768103-5997421.pdf?src-supplier=Farnell; ComponentLink6URL: https://datasheet.ciiva.com/2973/lm324ka-2973348.pdf?src-supplier=Avnet; ComponentLink6Description: https://datasheet.ciiva.com/2973/lm324ka-2973348.pdf?src-supplier=Avnet; ComponentLink7URL: https://datasheet.ciiva.com/7709/1840878-7709814.pdf?src-supplier=Element14; ComponentLink7Description: https://datasheet.ciiva.com/7709/1840878-7709814.pdf?src-supplier=Element14; ComponentLink8URL: https://datasheet.ciiva.com/46385/1877076-46385751.pdf?src-supplier=Element14; ComponentLink8Description: https://datasheet.ciiva.com/46385/1877076-46385751.pdf?src-supplier=Element14; ComponentLink9Description: Link Digikey; ComponentLink9URL: https://www.digikey.kr/en/products/detail/texas-instruments/LM324DR/555719
IC2 = LDO; 3V3; 1A; SMD; AZ1117EH-3.3TRG1: Linear Voltage Regulator IC 1 Output 1A SOT-223; MF: Diodes Inc.; Designer: TVBac; Package: SOT-223 Diodes Inc.; Value: *; Price: None; MP: AZ1117EH-3.3TRG1; SnapEDA_Link: https://www.snapeda.com/parts/AZ1117EH-3.3TRG1/Diodes%20Inc./view-part/482930/?ref=snap; Availability: Unavailable; ComponentLink1Description: Link Digikey; ComponentLink1URL: https://www.digikey.com/en/products/detail/diodes-incorporated/AZ1117EH-3-3TRG1/5001329
IC3 = ADE7753ARSZ: Single Phase Multifunction Metering IC 20-Pin SSOP Tube; Manufacturer: Analog Devices; Designer: TVBac; Supplier: Mouser; Supplier Part Number: 584-ADE7753ARSZ; Manufacturer Part Number: ADE7753ARSZ; RoHS: Yes; Category: Analog to Digital Converters (ADCs); Stock: 239; Pricing: 1=7.3, 10=5.71, 50=5.04, 100=3.91, 1000=3.51, 10000=3.37 (USD); ComponentLink1URL: https://datasheet.ciiva.com/15373/ade7753-249340-15373717.pdf?src-supplier=Mouser; ComponentLink1Description: https://datasheet.ciiva.com/15373/ade7753-249340-15373717.pdf?src-supplier=Mouser; ComponentLink2URL: https://datasheet.ciiva.com/1166/1610806-1166771.pdf?src-supplier=Element14; ComponentLink2Description: https://datasheet.ciiva.com/1166/1610806-1166771.pdf?src-supplier=Element14; ComponentLink3URL: https://datasheet.ciiva.com/15134/getdatasheetpartid-132040-15134272.pdf?src-supplier=Verical; ComponentLink3Description: https://datasheet.ciiva.com/15134/getdatasheetpartid-132040-15134272.pdf?src-supplier=Verical; ComponentLink4URL: https://datasheet.ciiva.com/1941/ade7753-1941429.pdf?src-supplier=Digikey; ComponentLink4Description: https://datasheet.ciiva.com/1941/ade7753-1941429.pdf?src-supplier=Digikey; ComponentLink5URL: https://datasheet.ciiva.com/22621/1610806-22621637.pdf?src-supplier=Element14; ComponentLink5Description: https://datasheet.ciiva.com/22621/1610806-22621637.pdf?src-supplier=Element14; ComponentLink6URL: https://datasheet.ciiva.com/3148/ade7753-3148700.pdf?src-supplier=Avnet; ComponentLink6Description: https://datasheet.ciiva.com/3148/ade7753-3148700.pdf?src-supplier=Avnet; ComponentLink7URL: https://datasheet.ciiva.com/1168/1610806-1168083.pdf?src-supplier=Element14; ComponentLink7Description: https://datasheet.ciiva.com/1168/1610806-1168083.pdf?src-supplier=Element14; ComponentLink8URL: https://datasheet.ciiva.com/5697/ade7753-5697029.pdf?src-supplier=Farnell; ComponentLink8Description: https://datasheet.ciiva.com/5697/ade7753-5697029.pdf?src-supplier=Farnell; ComponentLink9URL: https://datasheet.ciiva.com/48694/001249930-da-01-en-ic-energy-meteri-ade7753arsz-ssop-20-adi-48694326.pdf?src-supplier=Conrad; ComponentLink9Description: https://datasheet.ciiva.com/48694/001249930-da-01-en-ic-energy-meteri-ade7753arsz-ssop-20-adi-48694326.pdf?src-supplier=Conrad; ComponentLink10Description: Link Digikey; ComponentLink10URL: https://www.digikey.com/en/products/detail/analog-devices-inc/ADE7753ARSZ/671181
J1 = HEADER; 4PIN; 1.27; VER; TMS-104-02-G-S: Conn Unshrouded Header HDR 4 POS 1.27mm Solder ST Top Entry Thru-Hole Bulk; Manufacturer: Samtec; Number of Contacts: 4; Gender: Male; Designer: TVBac; Supplier: Avnet; Supplier Part Number: TMS-104-02-G-S; Manufacturer Part Number: TMS-104-02-G-S; RoHS: Yes; Category: Connectors; Stock: 309; Pricing: 1=0.7301, 10=0.63668, 30=0.63341, 50=0.63015, 100=0.48 (USD); Mounting Technology: Through Hole; Contact Plating: Gold; Contact Material: Bronze; Contact Shape: Square; Contact Finish - Mating: GOLD; Insulation Material: Polymer; Insulation Color: Black; Min Operating Temperature: -55°C; Max Operating Temperature: 125°C; Number of Rows: 1; Packaging: Bulk; Termination: Solder; Series: TMS; Connector Type: Header; Fastening Type: Pull; Contact Type: Male Pin; Number of Positions: 4; Pitch: 1.27mm; Radiation Hardening: No; Reach SVHC Compliant: No; RoHS Compliant: Yes; Flammability Rating: UL94 V-0; ComponentLink1URL: http://www.farnell.com/datasheets/1992060.pdf?_ga=2.199389226.569325269.1503285096-1413671594.1503025027&src-supplier=Farnell; ComponentLink1Description: http://www.farnell.com/datasheets/1992060.pdf?_ga=2.199389226.569325269.1503285096-1413671594.1503025027&src-supplier=Farnell; ComponentLink2URL: http://www.samtec.com/documents/webfiles/pdf/HTMS_TH.PDF?src-supplier=Avnet; ComponentLink2Description: http://www.samtec.com/documents/webfiles/pdf/HTMS_TH.PDF?src-supplier=Avnet; ComponentLink3URL: http://suddendocs.samtec.com/prints/tms-1xx-xx-xx-x-xx-xxx-mkt.pdf?src-supplier=Digikey; ComponentLink3Description: http://suddendocs.samtec.com/prints/tms-1xx-xx-xx-x-xx-xxx-mkt.pdf?src-supplier=Digikey; System: Connector; ComponentLink4Description: Link Digikey; ComponentLink4URL: https://www.digikey.com/en/products/detail/samtec-inc/TMS-104-02-G-S/6691742
J2 = HEADER; 15x2PIN; 2.54; HOR;: Designer: TVBac; System: Connector
M1 = ESP32-WROOM-WROVE-32E-H4; SMD;: Rf Txrx Module Bt Trace Ant SMD; Manufacturer: Espressif Systems; Manufacturer Part Number: ESP32-WROOM-32E-H4; Designer: TVBac; Supplier: Digikey; Supplier Part Number: 1965-ESP32-WROOM-32E-H4CT-ND; RoHS: No; Category: LDO; Stock: 7552; Pricing: 1=2.68 (USD); ComponentLink1Description: Link Datasheet; ComponentLink1URL: https://www.espressif.com/sites/default/files/documentation/esp32-wroom-32e_esp32-wroom-32ue_datasheet_en.pdf; ComponentLink2Description: Link Digikey; ComponentLink2URL: https://www.digikey.com/en/products/detail/espressif-systems/ESP32-WROOM-32E-H4/12696413
R1-R4 R6-R8 R11 R32 = RES; 10K; 0603; SMD; ESR03EZPF1002: SMD Chip Resistor, 10 kOhm, ± 1%, 250 mW, 0603 [1608 Metric], Thick Film, Anti-Surge; Manufacturer: Rohm; Power Rating: 250mW; Temperature Coefficient: 100ppm/°C; Voltage Rating (DC): 150V; Designer: TVBac; Supplier: Digikey; Supplier Part Number: RHM10KADCT-ND; Manufacturer Part Number: ESR03EZPF1002; RoHS: Yes; Category: Chip SMD Resistors; Stock: 2136779; Pricing: 1=0.16, 10=0.078, 50=0.0516, 100=0.044, 500=0.03138, 1000=0.02764 (USD); Case/Package: 0603; Case Code (Metric): 1608; Case Code (Imperial): 0603; Min Operating Temperature: -55°C; Max Operating Temperature: 155°C; Tolerance: 1%; Package Quantity: 1; Packaging: Cut Tape; Number of Terminations: 2; Max Power Dissipation: 250mW; Features: Automotive AEC-Q200; Series: ESR; Length: 0.063inch; Width: 0.031inch; Height: 0.022inch; Ratings: AEC-Q200; RoHS Compliant: Yes; Lead Free: 5697LeadFree; ComponentLink1URL: https://datasheet.ciiva.com/2469/esr-2469710.pdf?src-supplier=Digikey; ComponentLink1Description: https://datasheet.ciiva.com/2469/esr-2469710.pdf?src-supplier=Digikey; ComponentLink2URL: https://datasheet.ciiva.com/2469/esr-2469711.pdf?src-supplier=Digikey; ComponentLink2Description: https://datasheet.ciiva.com/2469/esr-2469711.pdf?src-supplier=Digikey; ComponentLink3URL: https://datasheet.ciiva.com/2469/esr-2469709.pdf?src-supplier=Digikey; ComponentLink3Description: https://datasheet.ciiva.com/2469/esr-2469709.pdf?src-supplier=Digikey; ComponentLink4Description: Link Digikey; ComponentLink4URL: https://www.digikey.com/en/products/detail/rohm-semiconductor/ESR03EZPF1002/1983429
R9 R12 R13 R16-R18 R20 = RES; 100R; 0603; SMD; KTR03EZPF1000: Res Thick Film 0603 100 Ohm 1% 0.1W(1/10W) ±100ppm/C Pad SMD T/R Automotive AEC-Q200; Manufacturer: Rohm; Max Power Dissipation: 100mW; Temperature Coefficient: 100ppm/°C; Voltage Rating: 350V; Designer: TVBac; Supplier: Mouser; Supplier Part Number: 755-KTR03EZPF1000; Manufacturer Part Number: KTR03EZPF1000; RoHS: Yes; Category: Chip SMD Resistors; Stock: 66325; Pricing: 1=0.12, 10=0.039, 50=0.039, 100=0.024, 1000=0.021, 10000=0.015 (USD); Case/Package: 0603; Case Code (Metric): 1608; Case Code (Imperial): 0603; Min Operating Temperature: -55°C; Max Operating Temperature: 155°C; Packaging: Cut Tape; Tolerance: 1%; Number of Terminations: 2; Features: Automotive AEC-Q200; Series: KTR; Voltage Rating (DC): 350V; Ratings: AEC-Q200; RoHS Compliant: Yes; ComponentLink1URL: https://datasheet.ciiva.com/14926/ktr-14926472.pdf?src-supplier=Digikey; ComponentLink1Description: https://datasheet.ciiva.com/14926/ktr-14926472.pdf?src-supplier=Digikey; ComponentLink2URL: https://datasheet.ciiva.com/14932/ktr-14932133.pdf?src-supplier=Digikey; ComponentLink2Description: https://datasheet.ciiva.com/14932/ktr-14932133.pdf?src-supplier=Digikey; ComponentLink3Description: Link Digikey; ComponentLink3URL: https://www.digikey.com/en/products/detail/rohm-semiconductor/KTR03EZPF1000/4051558
R10 R14 R19 R23 R28 R30 R31 R33 R36-R39 R42 R43 = RES; 1K; 0603; SMD; ESR03EZPF1001: SMD Chip Resistor, 1 kOhm, ± 1%, 250 mW, 0603 [1608 Metric], Thick Film, Anti-Surge; Manufacturer: Rohm; Voltage Rating: 150V; Designer: TVBac; Supplier: Digikey; Supplier Part Number: RHM1.00KADCT-ND; Manufacturer Part Number: ESR03EZPF1001; RoHS: Yes; Category: Chip SMD Resistors; Stock: 2703233; Pricing: 1=0.11, 10=0.055, 50=0.0364, 100=0.0309, 500=0.02206, 1000=0.01943 (USD); Voltage Rating (DC): 150V; Lead Free: 5697LeadFree; ComponentLink1URL: https://datasheet.ciiva.com/2469/esr-2469712.pdf?src-supplier=Digikey; ComponentLink1Description: https://datasheet.ciiva.com/2469/esr-2469712.pdf?src-supplier=Digikey; ComponentLink2URL: https://datasheet.ciiva.com/2469/esr-2469713.pdf?src-supplier=Digikey; ComponentLink2Description: https://datasheet.ciiva.com/2469/esr-2469713.pdf?src-supplier=Digikey; ComponentLink3URL: https://datasheet.ciiva.com/2469/esr-2469714.pdf?src-supplier=Digikey; ComponentLink3Description: https://datasheet.ciiva.com/2469/esr-2469714.pdf?src-supplier=Digikey; ComponentLink4Description: Link Digikey; ComponentLink4URL: https://www.digikey.com/en/products/detail/rohm-semiconductor/ESR03EZPF1001/1983428
R15 R21 R22 = RES; 4.7K; 0603; SMD; SFR03EZPF4701: Res Anti-Sulfured Thick Film 0603 4.7k Ohm 1% 1/10W ±100ppm/°C Molded Paper T/R; Manufacturer: Rohm; Power Rating: 100mW; Voltage Rating (DC): 50V; Designer: TVBac; Supplier: Mouser; Supplier Part Number: 755-SFR03EZPF4701; Manufacturer Part Number: SFR03EZPF4701; RoHS: Yes; Category: Chip SMD Resistors; Stock: 30180; Pricing: 1=0.14, 10=0.045, 50=0.045, 100=0.027, 1000=0.02, 10000=0.014 (USD); ComponentLink1URL: http://www.farnell.com/datasheets/2611943.pdf?src-supplier=Farnell; ComponentLink1Description: http://www.farnell.com/datasheets/2611943.pdf?src-supplier=Farnell; ComponentLink2URL: http://www.farnell.com/datasheets/2611943.pdf?src-supplier=Newark; ComponentLink2Description: http://www.farnell.com/datasheets/2611943.pdf?src-supplier=Newark; ComponentLink3URL: http://www.farnell.com/datasheets/2611943.pdf?src-supplier=Element14; ComponentLink3Description: http://www.farnell.com/datasheets/2611943.pdf?src-supplier=Element14; ComponentLink4URL: https://www.rohm.com/datasheet/SFR03EZPF/sfr-e?src-supplier=Digikey; ComponentLink4Description: https://www.rohm.com/datasheet/SFR03EZPF/sfr-e?src-supplier=Digikey; ComponentLink5Description: Link Digikey; ComponentLink5URL: https://www.digikey.com/en/products/detail/rohm-semiconductor/SFR03EZPF4701/9771855
R29 R34 R40 R41 R44 = RES; 100K; 0603; SMD; ESR03EZPJ104: Res Thick Film 0603 100K Ohm 5% 0.25W(1/4W) ±200ppm/C Pad SMD Automotive T/R; Manufacturer: Rohm; Voltage Rating: 150V; Designer: TVBac; Supplier: Digikey; Supplier Part Number: RHM100KDCT-ND; Manufacturer Part Number: ESR03EZPJ104; RoHS: Yes; Category: Chip SMD Resistors; Stock: 165361; Pricing: 1=0.1, 10=0.048, 50=0.0312, 100=0.0265, 500=0.0188, 1000=0.0165 (USD); Voltage Rating (DC): 150V; Lead Free: 5697LeadFree; ComponentLink1URL: https://datasheet.ciiva.com/14924/esr-14924811.pdf?src-supplier=Digikey; ComponentLink1Description: https://datasheet.ciiva.com/14924/esr-14924811.pdf?src-supplier=Digikey; ComponentLink2URL: https://datasheet.ciiva.com/14928/esr-14928813.pdf?src-supplier=Digikey; ComponentLink2Description: https://datasheet.ciiva.com/14928/esr-14928813.pdf?src-supplier=Digikey; ComponentLink3URL: https://datasheet.ciiva.com/14930/esr-14930633.pdf?src-supplier=Digikey; ComponentLink3Description: https://datasheet.ciiva.com/14930/esr-14930633.pdf?src-supplier=Digikey; ComponentLink4Description: Link Digikey; ComponentLink4URL: https://www.digikey.com/en/products/detail/rohm-semiconductor/ESR03EZPJ104/4051180
SW1 SW2 = BUT; SW; SMD; EVQ-P7L01P: Tactile Switch SPST-NO Side Actuated Surface Mount, Right Angle; MF: Panasonic Electronic Components; SnapEDA_Link: https://www.snapeda.com/parts/EVQ-P7L01P/Panasonic+Electronic+Components/view-part/?ref=snap; Package: None; MP: EVQ-P7L01P; Check_prices: https://www.snapeda.com/parts/EVQ-P7L01P/Panasonic+Electronic+Components/view-part/?ref=eda; Purchase-URL: https://pricing.snapeda.com/search/part/EVQ-P7L01P/?ref=eda; Digi-Key_Part_Number: P16769TR-ND; Value: *
SW3 = BUT; SW; SMD; PTS636SM50JSMTRLFS: Switch Tactile N.O. SPST Rectangular Button J-Bend 0.05A 12VDC 1.77N SMD T/R; Manufacturer: ITT C&K; Contact Resistance: 100mR; Number of Positions: 2NUMBER; Supplier: Digikey; Supplier Part Number: CKN12319-1-ND; Manufacturer Part Number: PTS636SM50JSMTRLFS; RoHS: No; Category: Tactile Switches; Stock: 80725; Pricing: 1=0.21, 10=0.199, 25=0.1888, 100=0.1717, 250=0.1614, 500=0.14766 (USD); ComponentLink1Description: Link Digikey; ComponentLink1URL: https://www.digikey.com/en/products/detail/c-k/PTS636-SM50J-SMTR-LFS/10071732
X1 = OSC; 3.58M; 3.579545M; ABLS-3.579545MHZ-B2-T: Crystal 3.579545MHz ±20ppm (Tol) ±50ppm (Stability) 18pF FUND 180Ohm 2-Pin HC-49/US SMD T/R; Manufacturer: Abracon; Designer: TVBac; Supplier: Digikey; Supplier Part Number: 535-9081-1-ND; Manufacturer Part Number: ABLS-3.579545MHZ-B2-T; RoHS: Yes; Category: Crystals; Stock: 16401; Pricing: 1=0.27, 10=0.231, 50=0.208, 100=0.1989, 500=0.17934, 1000=0.17152, 2000=0.16407, 3000=0.15987, 5000=0.15474, 7000=0.15146, 10000=0.14806, 25000=0.13969, 50000=0.13369 (USD); ComponentLink1URL: https://datasheet.ciiva.com/15116/getdatasheetpartid-719903-15116782.pdf?src-supplier=Verical; ComponentLink1Description: https://datasheet.ciiva.com/15116/getdatasheetpartid-719903-15116782.pdf?src-supplier=Verical; ComponentLink2URL: https://datasheet.ciiva.com/16410/abls-16410837.pdf?src-supplier=Future+Electronics; ComponentLink2Description: https://datasheet.ciiva.com/16410/abls-16410837.pdf?src-supplier=Future+Electronics; ComponentLink3URL: https://datasheet.ciiva.com/854/abls-854273.pdf?src-supplier=Digikey; ComponentLink3Description: https://datasheet.ciiva.com/854/abls-854273.pdf?src-supplier=Digikey; ComponentLink4URL: https://datasheet.ciiva.com/854/abls-854274.pdf?src-supplier=Digikey; ComponentLink4Description: https://datasheet.ciiva.com/854/abls-854274.pdf?src-supplier=Digikey; ComponentLink5URL: https://datasheet.ciiva.com/854/abls-854275.pdf?src-supplier=Digikey; ComponentLink5Description: https://datasheet.ciiva.com/854/abls-854275.pdf?src-supplier=Digikey; ComponentLink6URL: https://datasheet.ciiva.com/4945/abls-44621-4945006.pdf?src-supplier=Mouser; ComponentLink6Description: https://datasheet.ciiva.com/4945/abls-44621-4945006.pdf?src-supplier=Mouser; ComponentLink7URL: https://datasheet.ciiva.com/7998/abls-7998431.pdf?src-supplier=Element14; ComponentLink7Description: https://datasheet.ciiva.com/7998/abls-7998431.pdf?src-supplier=Element14; ComponentLink8Description: Link Digikey; ComponentLink8URL: https://www.digikey.com/en/products/detail/abracon-llc/ABLS-3-579545MHZ-B2-T/675276